# Altium schematic sheet [01] - COVER PAGE.SchDoc: COVER PAGE
size 433 x 279 mm; Author: ZAG; DrawnBy: ZAG; SheetNumber: 1; SheetTotal: 4; PageSetup: Record=PageOptions|CenterHorizontal=True|CenterVertical=True|PrintScale=0.96|XCorrection=1.00|YCorrection=1.00|PrintKind=2|BorderSize=5000000|LeftOffset=0|BottomOffset=0|Orientation=2|PaperLength=4318|PaperWidth=2794|Scale=100|PaperSource=15|PrintQuality=600|MediaType=1|DitherType=10|PaperKind=11x17|PrintScaleMode=1; SchRevision: 01; PCBRevision: 01; Project: HIGH ALTITUDE BALLOON; SchStatus: PRELIMINARY
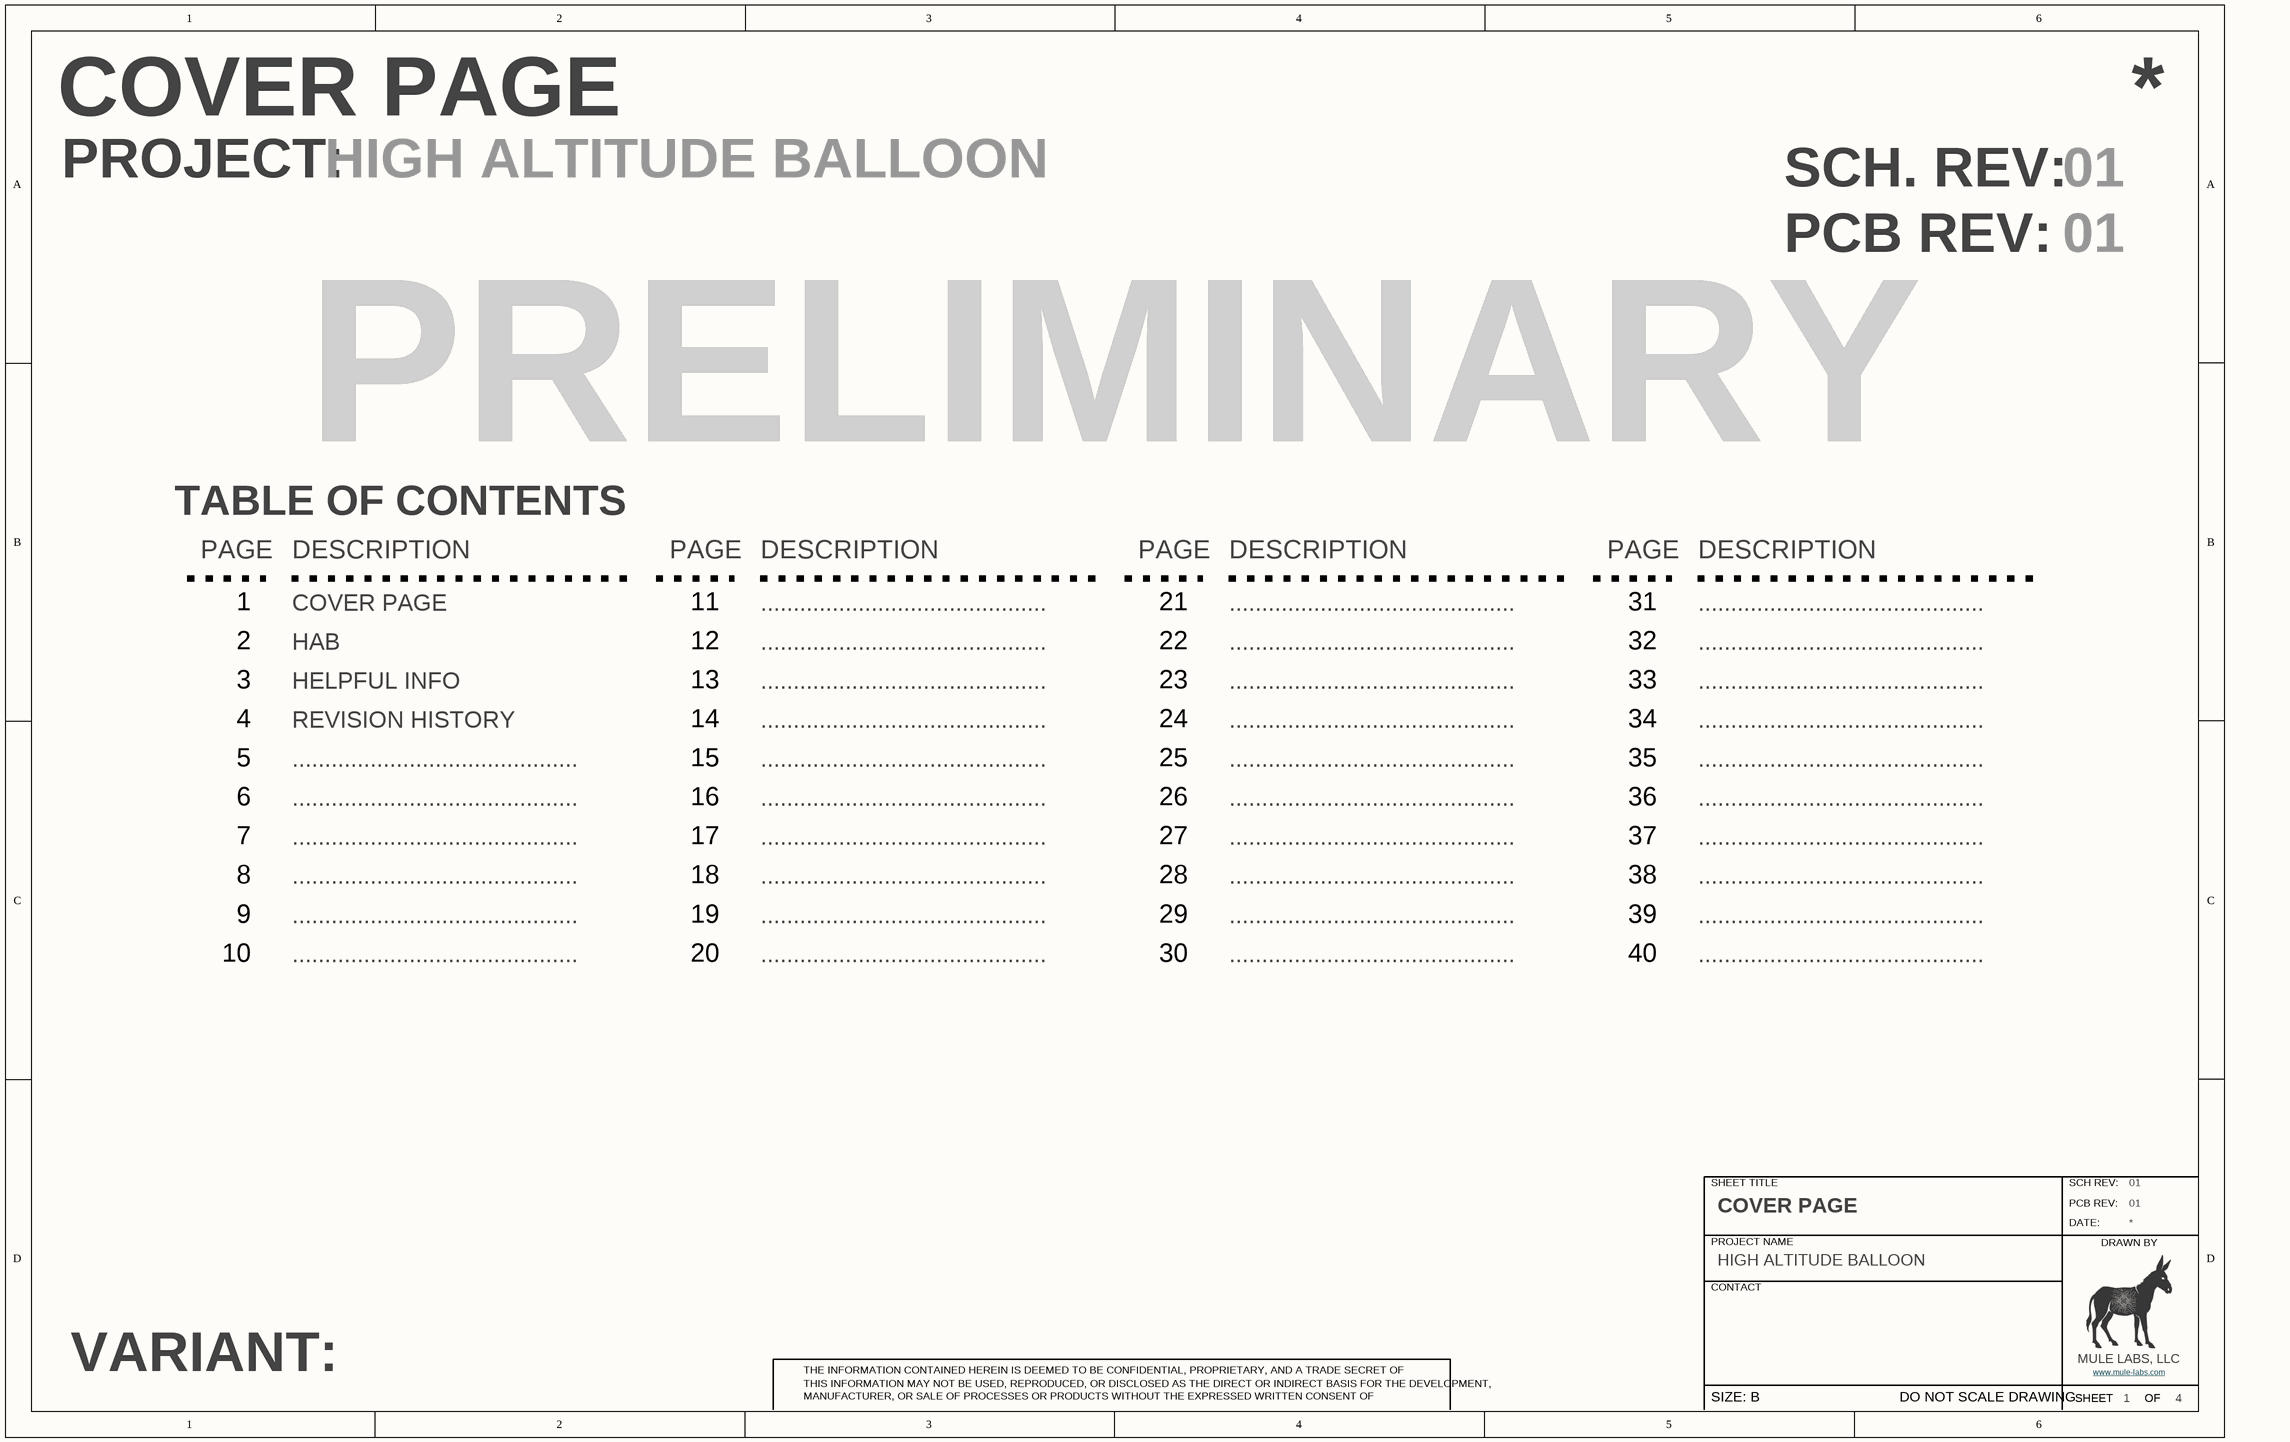
[diagram p0: [01] - COVER PAGE.SchDoc]

## Notes on the sheet
- PROJECT:
- SCH. REV:
- PCB REV:
- TABLE OF CONTENTS
- PAGE
- 1
- DESCRIPTION
- COVER PAGE
- 11
- ............................................
- 21
- 31
- 2
- HAB
- 12
- 22
- 32
- 3
- 4
- REVISION HISTORY
- HELPFUL INFO
- 13
- 14
- 23
- 24
- 33
- 34
- 5
- 6
- 15
- 16
- 25
- 26
- 35
- 36
- 7
- 17
- 27
- 37
- 8
- 9
- 18
- 19
- 28
- 29
- 38
- 39
- 10
- 20
- 30
- 40
- VARIANT:
- SHEET TITLE
- SCH REV:
- PROJECT NAME
- DATE:
- DRAWN BY
- CONTACT
- MANUFACTURER, OR SALE OF PROCESSES OR PRODUCTS WITHOUT THE EXPRESSED WRITTEN CONSENT OF
- THE INFORMATION CONTAINED HEREIN IS DEEMED TO BE CONFIDENTIAL, PROPRIETARY, AND A TRADE SECRET OF
- THIS INFORMATION MAY NOT BE USED, REPRODUCED, OR DISCLOSED AS THE DIRECT OR INDIRECT BASIS FOR THE DEVELOPMENT,
- SHEET
- MULE LABS, LLC
- www.mule-labs.com <http://www.mule-labs.com>
- OF
- SIZE: B
- DO NOT SCALE DRAWING